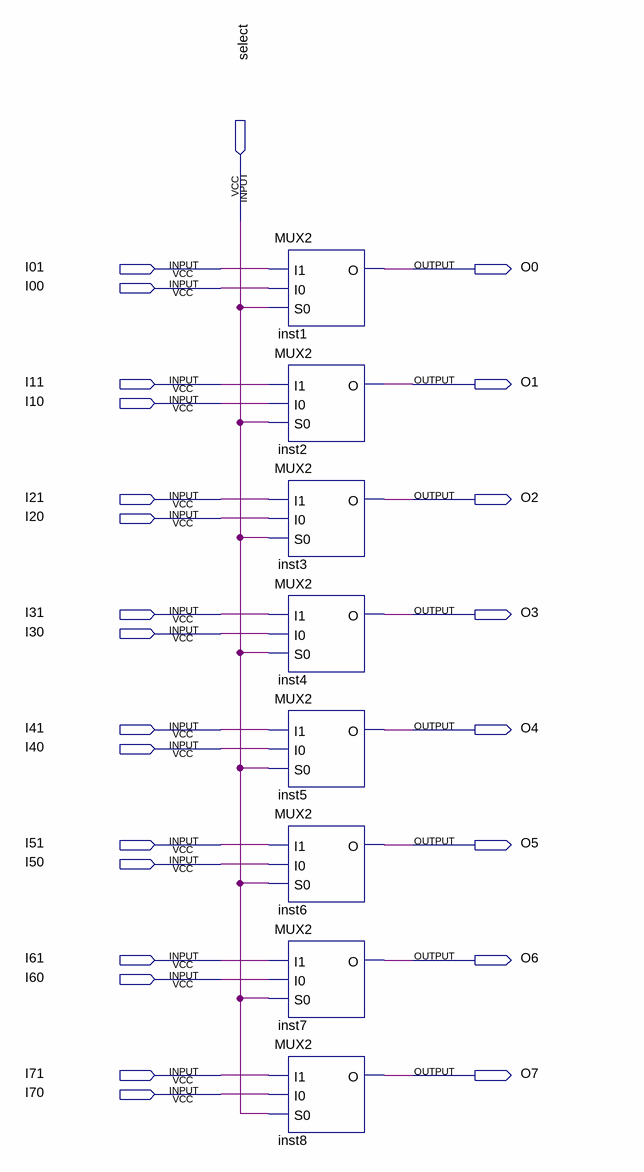
[diagram p0: schematic sheet]
// Quartus schematic super_MUX8.bdf as structural Verilog: 8 symbols, 25 pins
module super_MUX8 (
  input  select,
  input  I01,
  input  I00,
  input  I11,
  input  I10,
  input  I21,
  input  I20,
  input  I31,
  input  I30,
  input  I41,
  input  I40,
  input  I51,
  input  I50,
  input  I61,
  input  I60,
  input  I71,
  input  I70,
  output O0,
  output O1,
  output O2,
  output O3,
  output O4,
  output O5,
  output O6,
  output O7
);

  MUX2 inst1 (.I1(I01), .I0(I00), .S0(select), .O(O0));
  MUX2 inst2 (.I1(I11), .I0(I10), .S0(select), .O(O1));
  MUX2 inst3 (.I1(I21), .I0(I20), .S0(select), .O(O2));
  MUX2 inst4 (.I1(I31), .I0(I30), .S0(select), .O(O3));
  MUX2 inst5 (.I1(I41), .I0(I40), .S0(select), .O(O4));
  MUX2 inst6 (.I1(I51), .I0(I50), .S0(select), .O(O5));
  MUX2 inst7 (.I1(I61), .I0(I60), .S0(select), .O(O6));
  MUX2 inst8 (.I1(I71), .I0(I70), .S0(select), .O(O7));
endmodule
